# Altium project GY-G11.PRJPCB
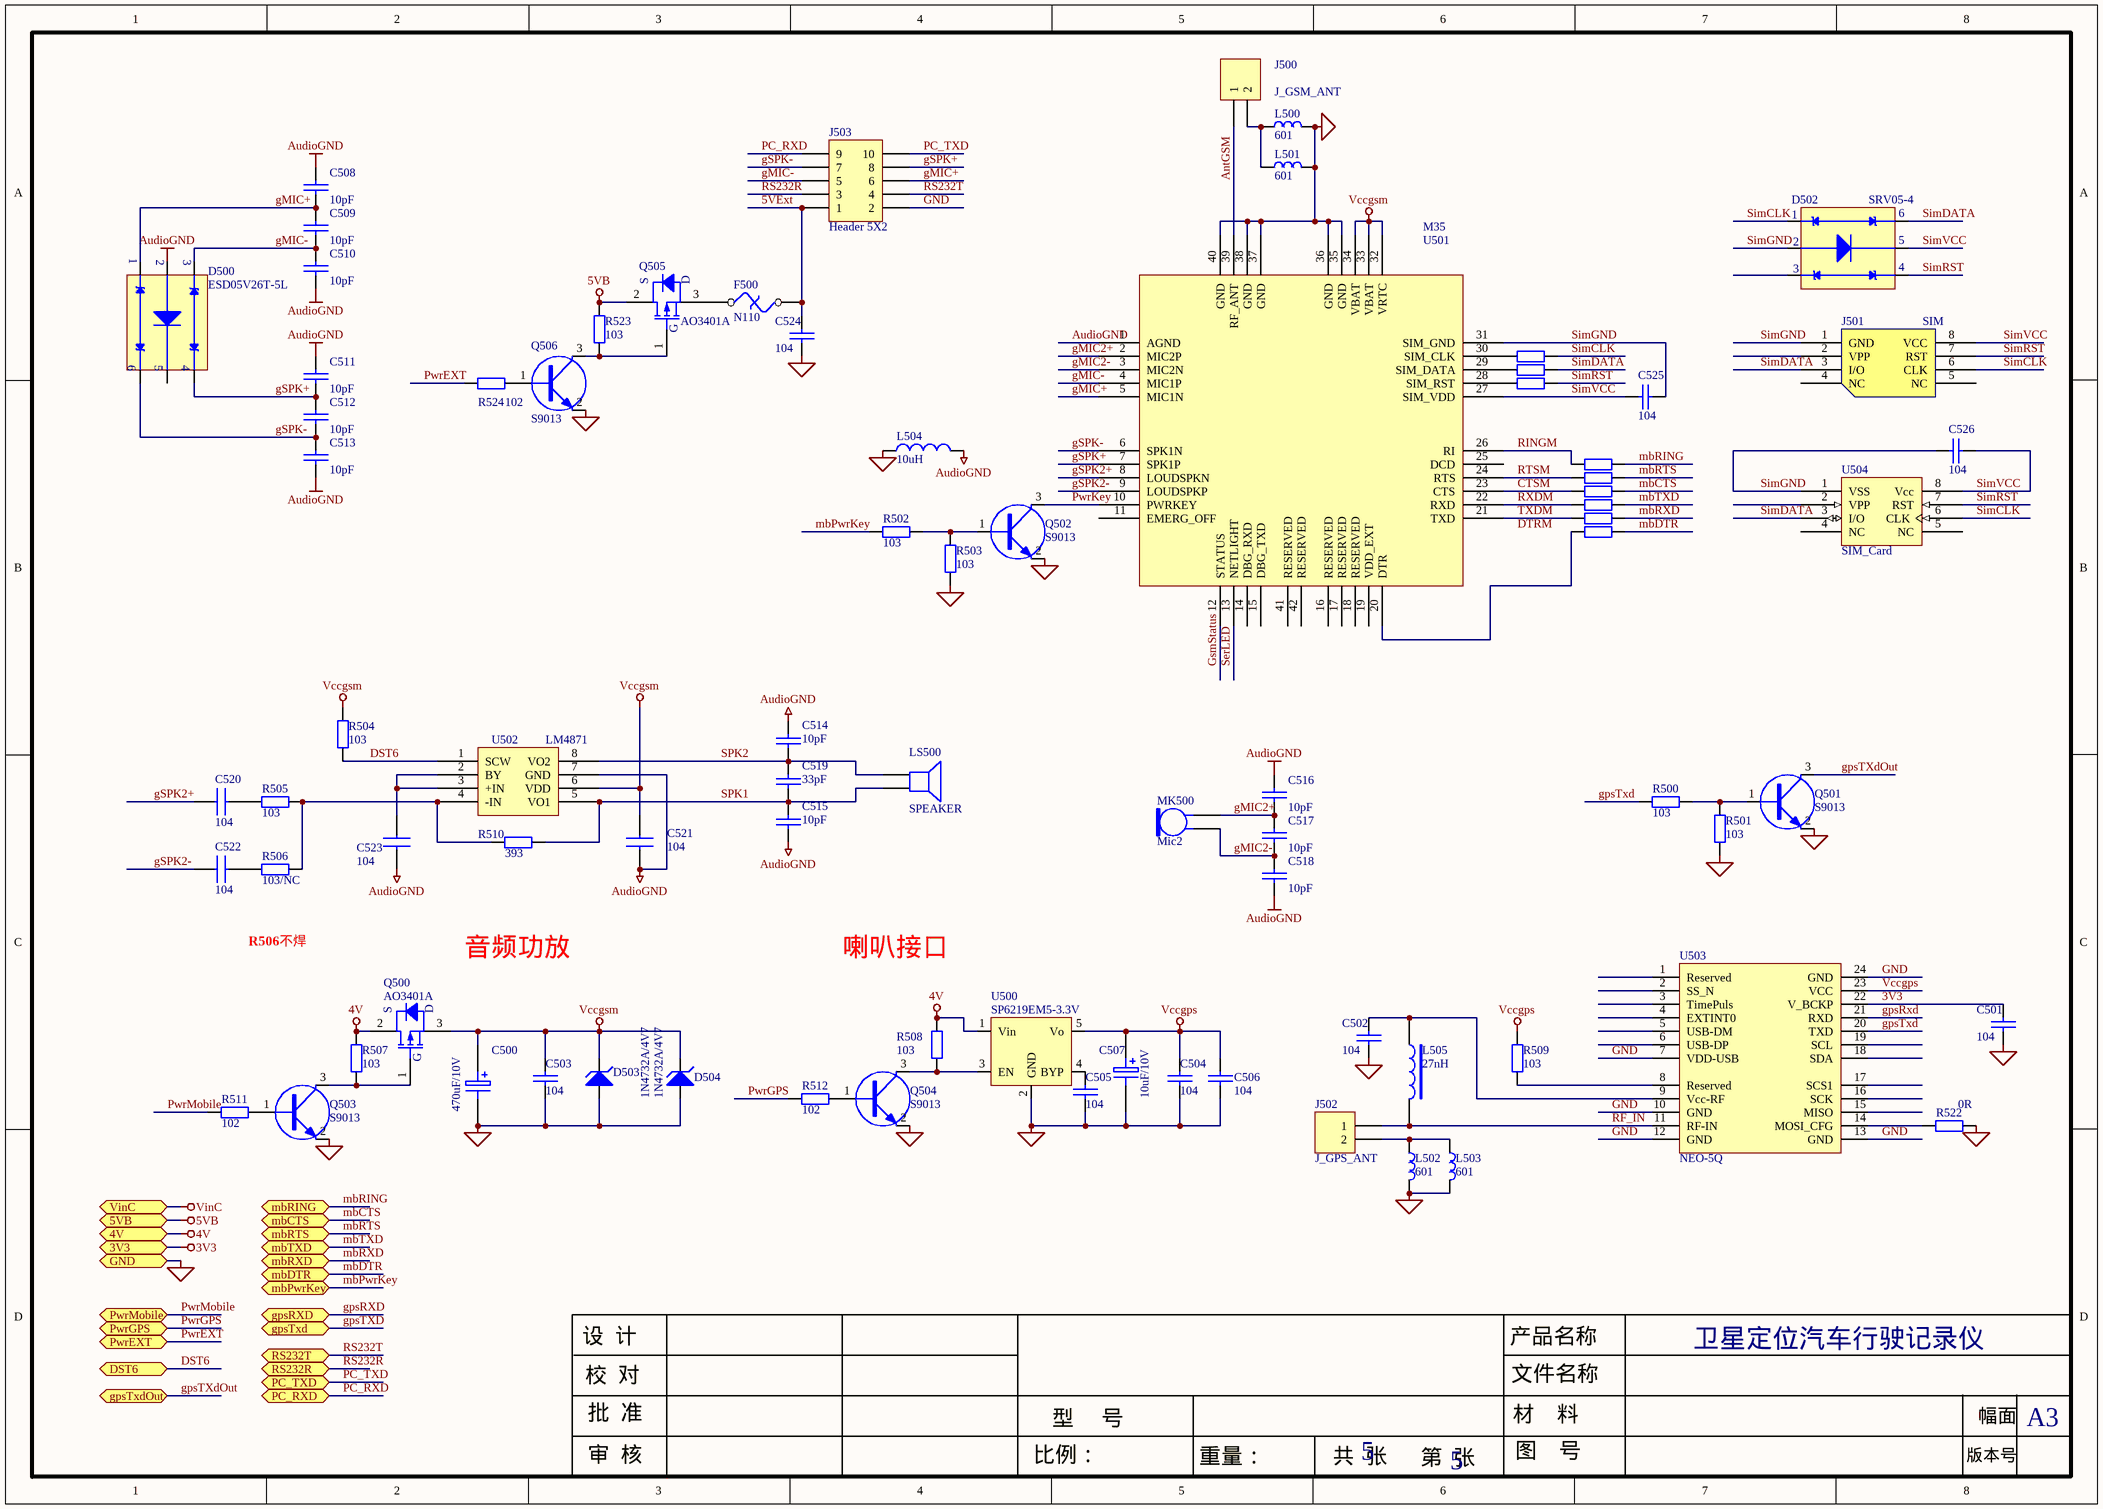
[diagram p0: G11_GPS-GSM.SCHDOC]
3 sheets, 196 parts. Net scope: flat (ports and power ports of the same name join across sheets).
Board file: GY-G11.PCBDOC
Sheets:
  G11_GPS-GSM.SCHDOC
  G11-KeyDispPrint.SCHDOC
  G11_IO_ADC.SCHDOC

## Sheet G11_GPS-GSM.SCHDOC
size A3; SheetNumber: 0; SheetTotal: 0

### Parts
C500  470uF/10V  [RB-3.5mm]
C501  104  [C0603]
C502  104  [C0603]
C503  104  [C0603]
C504  104  [C0603]
C505  104  [C0603]
C506  104  [C0603]
C507  10uF/10V  [A(3216)]
C508  10pF  [C0603]
C509  10pF  [C0603]
C510  10pF  [C0603]
C511  10pF  [C0603]
C512  10pF  [C0603]
C513  10pF  [C0603]
C514  10pF  [C0603]
C515  10pF  [C0603]
C516  10pF  [C0603]
C517  10pF  [C0603]
C518  10pF  [C0603]
C519  33pF  [C0603]
C520  104  [C0603]
C521  104  [C0603]
C522  104  [C0603]
C523  104  [C0603]
C524  104  [C0603]
C525  104  [C0603]
C526  104  [C0603]
D500  ESD05V26T-5L  [SOT-236]
D502  SRV05-4  [SOT-236]
D503  1N4732A/4V7  [D1206]
D504  1N4732A/4V7  [D1206]
F500  N110  [F0820]
J500  J_GSM_ANT  [ANT-SMA]
J501  SIM  [SIM3-8P]
J502  J_GPS_ANT  [ANT-SMA]
J503  Header 5X2  [HDR2X5-3MM]
L500  601  [0603]
L501  601  [0603]
L502  601  [0603]
L503  601  [0603]
L504  10uH  [0603]
L505  27nH  [0603]
LS500  SPEAKER  [BT-2.0]
MK500  Mic2  [BT-2.0]
Q500  AO3401A  [SOT-233PM]
Q501  S9013  [SOT-233]
Q502  S9013  [SOT-233]
Q503  S9013  [SOT-233]
Q504  S9013  [SOT-233]
Q505  AO3401A  [SOT-233PM]
Q506  S9013  [SOT-233]
R500  103  [R0603]
R501  103  [R0603]
R502  103  [R0603]
R503  103  [R0603]
R504  103  [R0603]
R505  103  [R0603]
R506  103/NC  [R0603]
R507  103  [R0603]
R508  103  [R0603]
R509  103  [R0603]
R510  393  [R0603]
R511  102  [R0603]
R512  102  [R0603]
R513  18R  [R0603]  (value not drawn)
R514  18R  [R0603]  (value not drawn)
R515  18R  [R0603]  (value not drawn)
R516  471  [R0603]  (value not drawn)
R517  471  [R0603]  (value not drawn)
R518  471  [R0603]  (value not drawn)
R519  471  [R0603]  (value not drawn)
R520  471  [R0603]  (value not drawn)
R521  471  [R0603]  (value not drawn)
R522  0R  [R0603]
R523  103  [R0603]
R524  102  [R0603]
U500  SP6219EM5-3.3V  [SOT-235]
U501  M35  [M35]
U502  LM4871  [SMD8A]
U503  NEO-5Q  [NEO-5Q]
U504  SIM_Card  [QFN5*6-8]

### Ports
3V3 (bidir), 4V (bidir), 5VB (bidir), DST6 (bidir), GND (bidir), gpsRXD (bidir), gpsTxd (bidir), gpsTxdOut (bidir), mbCTS (bidir), mbDTR (bidir), mbPwrKey (bidir), mbRING (bidir), mbRTS (bidir), mbRXD (bidir), mbTXD (bidir), PC_RXD (bidir), PC_TXD (bidir), PwrEXT (bidir), PwrGPS (bidir), PwrMobile (bidir), RS232R (bidir), RS232T (bidir), VinC (bidir)

### Nets
3V3: C501.1 U503.22(V_BCKP) ; port 3V3
4V: Q500.2(D) R507.1 R508.2 U500.1(Vin) ; port 4V
5VB: Q505.2(D) R523.1 ; port 5VB
AudioGND: C508.1 C510.2 C511.1 C513.2 C514.2 C515.1 C516.1 C518.2 C521.2 C523.2 D500.2 L504.2 U501.1(AGND) U502.7(GND)
GND: C500.2 C501.2 C502.2 C503.2 C504.2 C505.2 C506.1 C507.2 C524.2 D503.1(A) D504.1(A) J503.2 L500.2 L501.2 L502.2 L503.2 L504.1 Q501.2(E) Q502.2(E) Q503.2(E) Q504.2(E) Q506.2(E) R501.1 R503.1 R522.1 U500.2(GND) U501.35(GND) U501.36(GND) U501.37(GND) U501.38(GND) U501.40(GND) U503.7(VDD-USB) U503.10(GND) U503.12(GND) U503.13(GND) U503.24(GND) ; port GND
Vccgps: C504.1 C506.2 C507.1 R509.2 U500.5(Vo) U503.23(VCC)
Vccgsm: C500.1 C503.1 C521.1 D503.2(K) D504.2(K) Q500.3(S) R504.1 U501.32(VRTC) U501.33(VBAT) U501.34(VBAT) U502.6(VDD)
5VExt: C524.1 F500.1 J503.1
AntGSM: J500.1 U501.39(RF_ANT)
CTSM: R518.1 U501.23(CTS)
DST6: R504.2 U502.1(SCW) ; port DST6
gMIC2+: C516.2 C517.1 MK500.1 U501.2(MIC2P)
gMIC2-: C517.2 C518.1 MK500.2 U501.3(MIC2N)
gMIC+: C508.2 C509.1 D500.1 J503.6 U501.5(MIC1N)
gMIC-: C509.2 C510.1 D500.3 J503.5 U501.4(MIC1P)
gpsRxd: U503.21(RXD) ; port gpsRXD
gpsTxd: R500.2 U503.20(TXD) ; port gpsTxd
gpsTXdOut: Q501.3(C) ; port gpsTxdOut
GsmStatus: U501.12(STATUS)
gSPK2+: C520.1 U501.8(LOUDSPKN)
gSPK2-: C522.1 U501.9(LOUDSPKP)
gSPK+: C511.2 C512.1 D500.4 J503.8 U501.7(SPK1P)
gSPK-: C512.2 C513.1 D500.6 J503.7 U501.6(SPK1N)
mbCTS: R518.2 ; port mbCTS
mbDTR: R521.2 ; port mbDTR
mbPwrKey: R502.2 ; port mbPwrKey
mbRING: R516.2 ; port mbRING
mbRTS: R517.2 ; port mbRTS
mbRXD: R520.2 ; port mbRXD
mbTXD: R519.2 ; port mbTXD
PC_RXD: J503.9 ; port PC_RXD
PC_TXD: J503.10 ; port PC_TXD
PwrEXT: R524.2 ; port PwrEXT
PwrGPS: R512.2 ; port PwrGPS
PwrKey: Q502.3(C) U501.10(PWRKEY)
PwrMobile: R511.2 ; port PwrMobile
RF_IN: J502.1 L505.1 U503.11(RF-IN)
RINGM: R516.1 U501.26(RI)
RS232R: J503.3 ; port RS232R
RS232T: J503.4 ; port RS232T
RTSM: R517.1 U501.24(RTS)
RXDM: R519.1 U501.22(RXD)
SerLED: U501.13(NETLIGHT)
SimCLK: D502.1 J501.6(CLK) R513.2 U504.6(CLK)
SimDATA: D502.6 J501.3(I/O) R514.2 U504.3(I/O)
SimGND: C525.2 C526.1 D502.2 J501.1(GND) U501.31(SIM_GND) U504.1(VSS)
SimRST: D502.4 J501.7(RST) R515.2 U504.7(RST)
SimVCC: C525.1 C526.2 D502.5 J501.8(VCC) U501.27(SIM_VDD) U504.8(Vcc)
SPK1: C515.2 C519.1 LS500.2 R510.2 U502.5(VO1)
SPK2: C514.1 C519.2 LS500.1 U502.8(VO2)
TXDM: R520.1 U501.21(TXD)
NetC502_1: C502.1 L505.2 U503.9(Vcc-RF)
NetC505_1: C505.1 U500.4(BYP)
NetC520_2: C520.2 R505.1
NetC522_2: C522.2 R506.1
NetC523_1: C523.1 U502.2(BY) U502.3(+IN)
NetF500_2: F500.2 Q505.3(S)
NetJ500_2: J500.2 L500.1 L501.1
NetJ502_2: J502.2 L502.1 L503.1
NetQ500_1: Q500.1(G) Q503.3(C) R507.2
NetQ501_1: Q501.1(B) R500.1 R501.2
NetQ502_1: Q502.1(B) R502.1 R503.2
NetQ503_1: Q503.1(B) R511.1
NetQ504_1: Q504.1(B) R512.1
NetQ504_3: Q504.3(C) R508.1 U500.3(EN)
NetQ505_1: Q505.1(G) Q506.3(C) R523.2
NetQ506_1: Q506.1(B) R524.1
NetR505_2: R505.2 R506.2 R510.1 U502.4(-IN)
NetR509_1: R509.1 U503.8(Reserved)
NetR513_1: R513.1 U501.30(SIM_CLK)
NetR514_1: R514.1 U501.29(SIM_DATA)
NetR515_1: R515.1 U501.28(SIM_RST)
NetR521_1: R521.1 U501.20(DTR)
NetR522_2: R522.2 U503.14(MOSI_CFG)

Not connected (* = marked no-connect by the designer): D500 5; D502 3; J501 2(VPP) 4(NC) 5(NC); U501 11(EMERG_OFF) 14(DBG_RXD) 15(DBG_TXD) 16(RESERVED) 17(RESERVED) 18(RESERVED) 19(VDD_EXT) 25(DCD) 41(RESERVED) 42(RESERVED); U503 1(Reserved) 2(SS_N) 3(TimePuls) 4(EXTINT0) 5(USB-DM) 6(USB-DP) 15(MISO) 16(SCK) 17(SCS1) 18(SDA) 19(SCL); U504 2(VPP) 4(NC) 5(NC)

### Notes on the sheet
- R506不焊
- 音频功放
- 喇叭接口
- 设  计
- 校  对
- 产品名称
- 文件名称
- 卫星定位汽车行驶记录仪
- 审  核
- 批  准
- 比例：
- 型     号
- 5
- 材    料
- 图    号
- 版本号
- 幅面
- A3
- 重量：
- 共  张
- 第  张
- Labels drawn without touching a wire or pin: DTRM

### Library data of the parts
C500 = ELECTRO1: 直插电解
C501-C506 C508-C513 C516-C519 C524-C526 = CAP: 贴片电容
  C506: C: 贴片电容
C507 = ELECTRO1: Electrolytic Capacitor
C514 C515 = CAP: Capacitor
C520-C523 = 04-02-01
D500 D502 = ESD4: 贴片ESD管; Manufacturer: Generic Components; Class: Discrete; SubClass: Diode - Zener; Published: 08/06/2000; Publisher: Altium Hobart Technology Centre
D503 D504 = D Zener: 贴片稳压管; Manufacturer: Generic Components; Class: Discrete; SubClass: Diode - Zener; Published: 08/06/2000; Publisher: Altium Hobart Technology Centre
F500 = THERMAL FUSE: 贴片自恢复保险丝; F: F
J500 = Header 2: GSM天线接口; Revision: 17-Jul-2002: Re-released for DXP Platform.; Publisher: Altium Limited
J501 = SIM_Card_Lock: 抽屉式SIM卡座
J502 = Header 2: GPS天线接口; Revision: 17-Jul-2002: Re-released for DXP Platform.; Publisher: Altium Limited
J503 = Header 5X2: Header, 5-Pin, Dual row; Revision: 17-Jul-2002: Re-released for DXP Platform.; Publisher: Altium Limited
L500-L503 = ChiZhu: 贴片磁珠; Manufacturer: Generic Components; Class: Passive; SubClass: Inductor; Published: 08/06/2000; Publisher: Altium Hobart Technology Centre; Value: 601
L504 = Inductor: 贴片电感; Manufacturer: Generic Components; Class: Passive; Published: 08/06/2000; Publisher: Altium Hobart Technology Centre; SubClass: Inductor; Value: 10uH
L505 = INDUCTOR2: 贴片电感; L: L
MK500 = Mic2: Microphone; Published: 24-Mar-1999; Revision: July-2002: Re-released for DXP Platform.; Publisher: Altium Limited
Q500 Q505 = MOSFET-P: 贴片P沟MOS管
Q501 Q502 = 9013: 贴片三极管
Q503 Q504 Q506 = 9013
R500-R503 R507 R508 R511-R521 R523 R524 = Res2: 贴片电阻; Manufacturer: Generic Components; Class: Passive; SubClass: Resistor; Value: 15K; Published: 08/06/2000; Publisher: Altium Hobart Technology Centre
R504-R506 R510 = Res2: Resistor; Manufacturer: Generic Components; Class: Passive; Value: 15K; Published: 08/06/2000; Publisher: Altium Hobart Technology Centre; SubClass: Resistor
R509 R522 = Res2: 贴片电阻; Manufacturer: Generic Components; Class: Passive; SubClass: Resistor; Value: 1K; Published: 08/06/2000; Publisher: Altium Hobart Technology Centre
U500 = SPX5205: 贴片电源LDO
U501 = M35: 贴片GPRS通讯模块
U502 = LM4871: 音频放大器
U503 = NEO-5Q: 定位模块
U504 = SIM_Card: 贴片SIM卡; FRAM: EEPROM WatchDog(贴片)

## Sheet G11-KeyDispPrint.SCHDOC
size A3; SheetNumber: 0; SheetTotal: 0
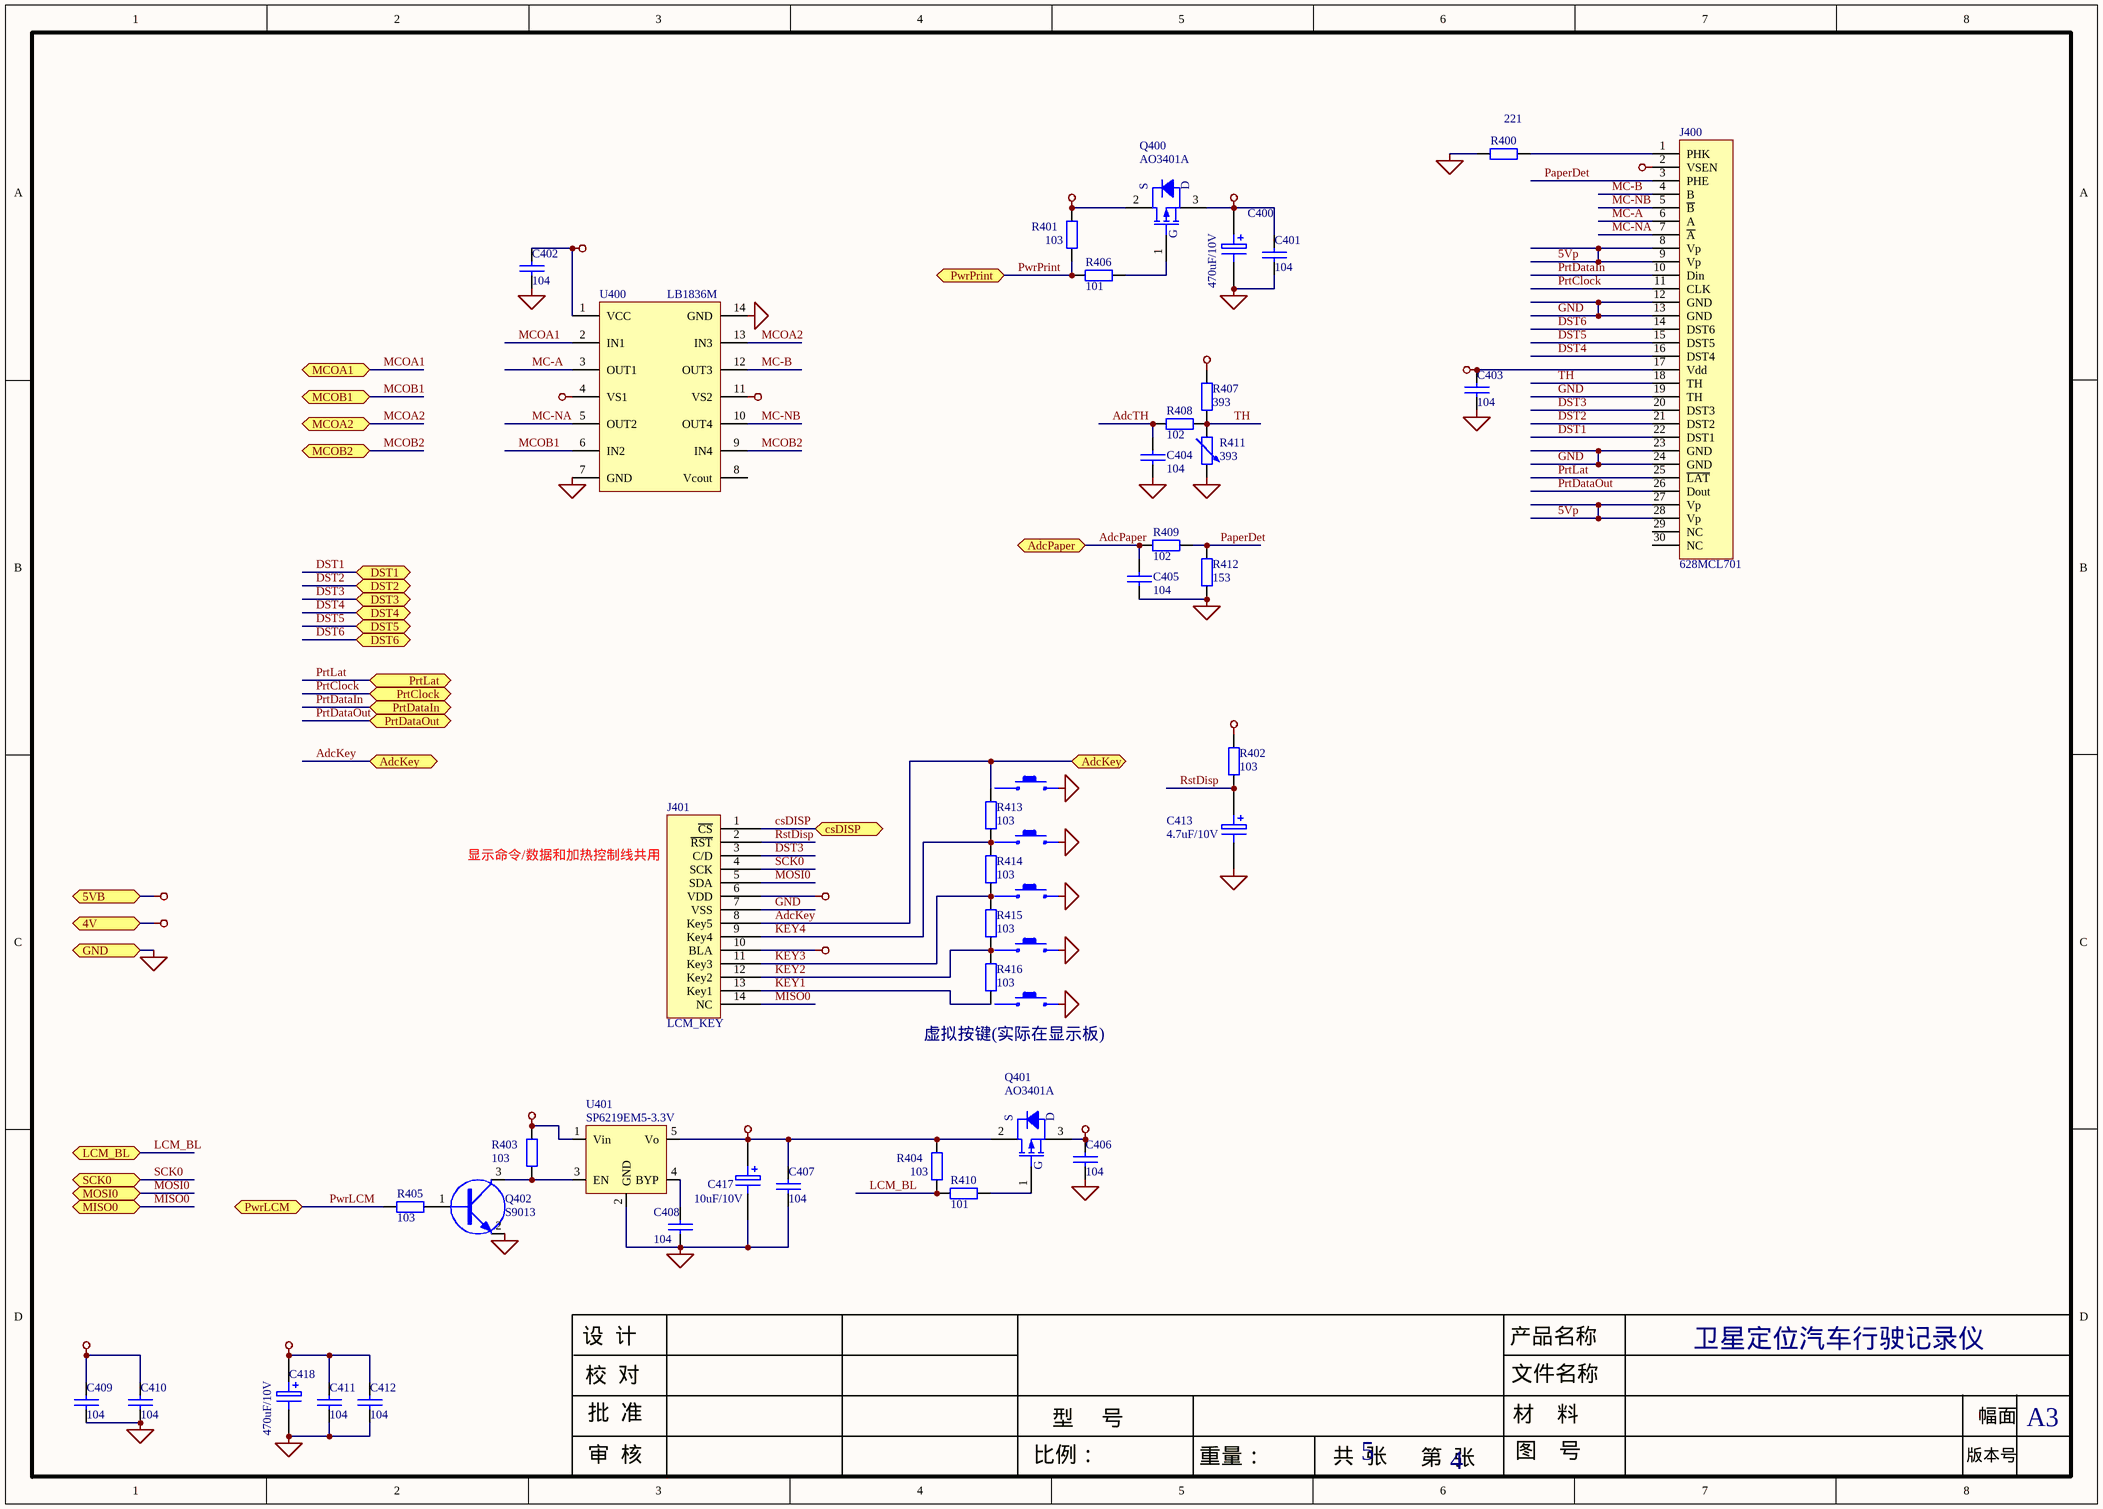
[diagram p1: G11-KeyDispPrint.SCHDOC]

### Parts
C400  470uF/10V  [RB-3.5mm]
C401  104  [C0603]
C402  104  [C0603]
C403  104  [C0603]
C404  104  [C0603]
C405  104  [C0603]
C406  104  [C0603]
C407  104  [C0603]
C408  104  [C0603]
C409  104  [C0603]
C410  104  [C0603]
C411  104  [C0603]
C412  104  [C0603]
C413  4.7uF/10V  [A(3216)]
C417  10uF/10V  [A(3216)]
C418  470uF/10V  [RB-3.5mm]
J400  628MCL701  [FPC-30H]
J401  LCM_KEY  [FPC-14-1.0]
Q400  AO3401A  [SOT-233PM]
Q401  AO3401A  [SOT-233PM]
Q402  S9013  [SOT-233]
R400  221  [R0603]
R401  103  [R0603]
R402  103  [R0603]
R403  103  [R0603]
R404  103  [R0603]
R405  103  [R0603]
R406  101  [R0603]
R407  393  [R0603]
R408  102  [R0603]
R409  102  [R0603]
R410  101  [R0603]
R411  value 393  [0603]  (hidden comment: Res Adj2)
R412  153  [R0603]
R413  103  [R0603]
R414  103  [R0603]
R415  103  [R0603]
R416  103  [R0603]
U400  LB1836M  [SO-G14-1.0mm]
U401  SP6219EM5-3.3V  [SOT-235]

### Ports
4V (bidir), 5VB (bidir), AdcKey, AdcKey (bidir), AdcPaper (bidir), csDISP (bidir), DST1 (bidir), DST2 (bidir), DST3 (bidir), DST4 (bidir), DST5 (bidir), DST6 (bidir), GND (bidir), LCM_BL (bidir), MCOA1 (bidir), MCOA2 (bidir), MCOB1 (bidir), MCOB2 (bidir), MISO0 (bidir), MOSI0 (bidir), PrtClock, PrtDataIn, PrtDataOut, PrtLat, PwrLCM (bidir), PwrPrint (bidir), SCK0 (bidir)

### Nets
3V3Lcm: C407.2 C417.1 J401.6(VDD) Q401.2(D) R402.1 R404.1 U401.5(Vo)
3V_BL: C406.2 J401.10(BLA) Q401.3(S)
4V: R403.2 U401.1(Vin) ; port 4V
5VB: C402.2 C409.2 C410.2 C411.2 C412.2 C418.1 Q400.2(D) R401.1 R407.1 U400.1(VCC) U400.4(VS1) U400.11(VS2) ; port 5VB
5Vp: C400.1 C401.2 C403.2 J400.2(VSEN) J400.8(Vp) J400.9(Vp) J400.17(Vdd) J400.27(Vp) J400.28(Vp) Q400.3(S)
GND: C400.2 C401.1 C402.1 C403.1 C404.2 C405.2 C406.1 C407.1 C408.1 C409.1 C410.1 C411.1 C412.1 C413.2 C417.2 C418.2 J400.12(GND) J400.13(GND) J400.19(TH) J400.23(GND) J400.24(GND) J401.7(VSS) Q402.2(E) R400.1 R411.2 R412.2 U400.7(GND) U400.14(GND) U401.2(GND) ; port GND
AdcKey: J401.8(Key5) R413.1 ; port AdcKey
AdcPaper: C405.1 R409.1 ; port AdcPaper
AdcTH: C404.1 R408.1
csDISP: J401.1(~{CS}) ; port csDISP
DST1: J400.22(DST1) ; port DST1
DST2: J400.21(DST2) ; port DST2
DST3: J400.20(DST3) J401.3(C/D) ; port DST3
DST4: J400.16(DST4) ; port DST4
DST5: J400.15(DST5) ; port DST5
DST6: J400.14(DST6) ; port DST6
KEY1: J401.13(Key1) R416.2
KEY2: J401.12(Key2) R415.2 R416.1
KEY3: J401.11(Key3) R414.2 R415.1
KEY4: J401.9(Key4) R413.2 R414.1
LCM_BL: R404.2 R410.2 ; port LCM_BL
MC-A: J400.6(A) U400.3(OUT1)
MC-B: J400.4(B) U400.12(OUT3)
MC-NA: J400.7(~{A}) U400.5(OUT2)
MC-NB: J400.5(~{B}) U400.10(OUT4)
MCOA1: U400.2(IN1) ; port MCOA1
MCOA2: U400.13(IN3) ; port MCOA2
MCOB1: U400.6(IN2) ; port MCOB1
MCOB2: U400.9(IN4) ; port MCOB2
MISO0: J401.14(NC) ; port MISO0
MOSI0: J401.5(SDA) ; port MOSI0
PaperDet: J400.3(PHE) R409.2 R412.1
PrtClock: J400.11(CLK) ; port PrtClock
PrtDataIn: J400.10(Din) ; port PrtDataIn
PrtDataOut: J400.26(Dout) ; port PrtDataOut
PrtLat: J400.25(~{LAT}) ; port PrtLat
PwrLCM: R405.2 ; port PwrLCM
PwrPrint: R401.2 R406.2 ; port PwrPrint
RstDisp: C413.1 J401.2(~{RST}) R402.2
SCK0: J401.4(SCK) ; port SCK0
TH: J400.18(TH) R407.2 R408.2 R411.1
NetC408_2: C408.2 U401.4(BYP)
NetJ400_1: J400.1(PHK) R400.2
NetQ400_1: Q400.1(G) R406.1
NetQ401_1: Q401.1(G) R410.1
NetQ402_1: Q402.1(B) R405.1
NetQ402_3: Q402.3(C) R403.1 U401.3(EN)

Not connected (* = marked no-connect by the designer): J400 29(NC) 30(NC); U400 8(Vcout)

### Notes on the sheet
- 显示命令/数据和加热控制线共用
- (near R416) 虚拟按键(实际在显示板)
- 设  计
- 校  对
- 产品名称
- 文件名称
- 卫星定位汽车行驶记录仪
- 审  核
- 批  准
- 比例：
- 型     号
- 5
- 材    料
- 图    号
- 版本号
- 幅面
- A3
- 重量：
- 共  张
- 第  张
- 4
- Labels drawn without touching a wire or pin: GND

### Library data of the parts
C400 C418 = ELECTRO1: 直插电解; C: Cap
C401-C403 C406-C412 = CAP: Capacitor; Cap: Cap
C404 C405 = CAP: Capacitor; Cap: 贴片电容
C413 = ELECTRO1: 贴片钽电容
C417 = ELECTRO1: 贴片钽电容; C: 电解电容
J400 = 628MCL701: 贴片竖焊打印机接口
Q400 Q401 = MOSFET-P: 贴片P沟MOS管
Q402 = 9013
R400-R410 R412-R416 = Res2: as R500 on sheet G11_GPS-GSM; Published: 08/06/2000; Publisher: Altium Hobart Technology Centre
R411 = Res Adj2: 贴片热敏电阻; Set Position: 0.5; Published: 8-Jun-2000; Revision: July-2002: Re-released for DXP Platform.; Publisher: Altium Limited
U400 = LB1836M: 贴片IC
U401 = SPX5205: 贴片电源LDO

## Sheet G11_IO_ADC.SCHDOC
size A3; SheetNumber: 0; SheetTotal: 0
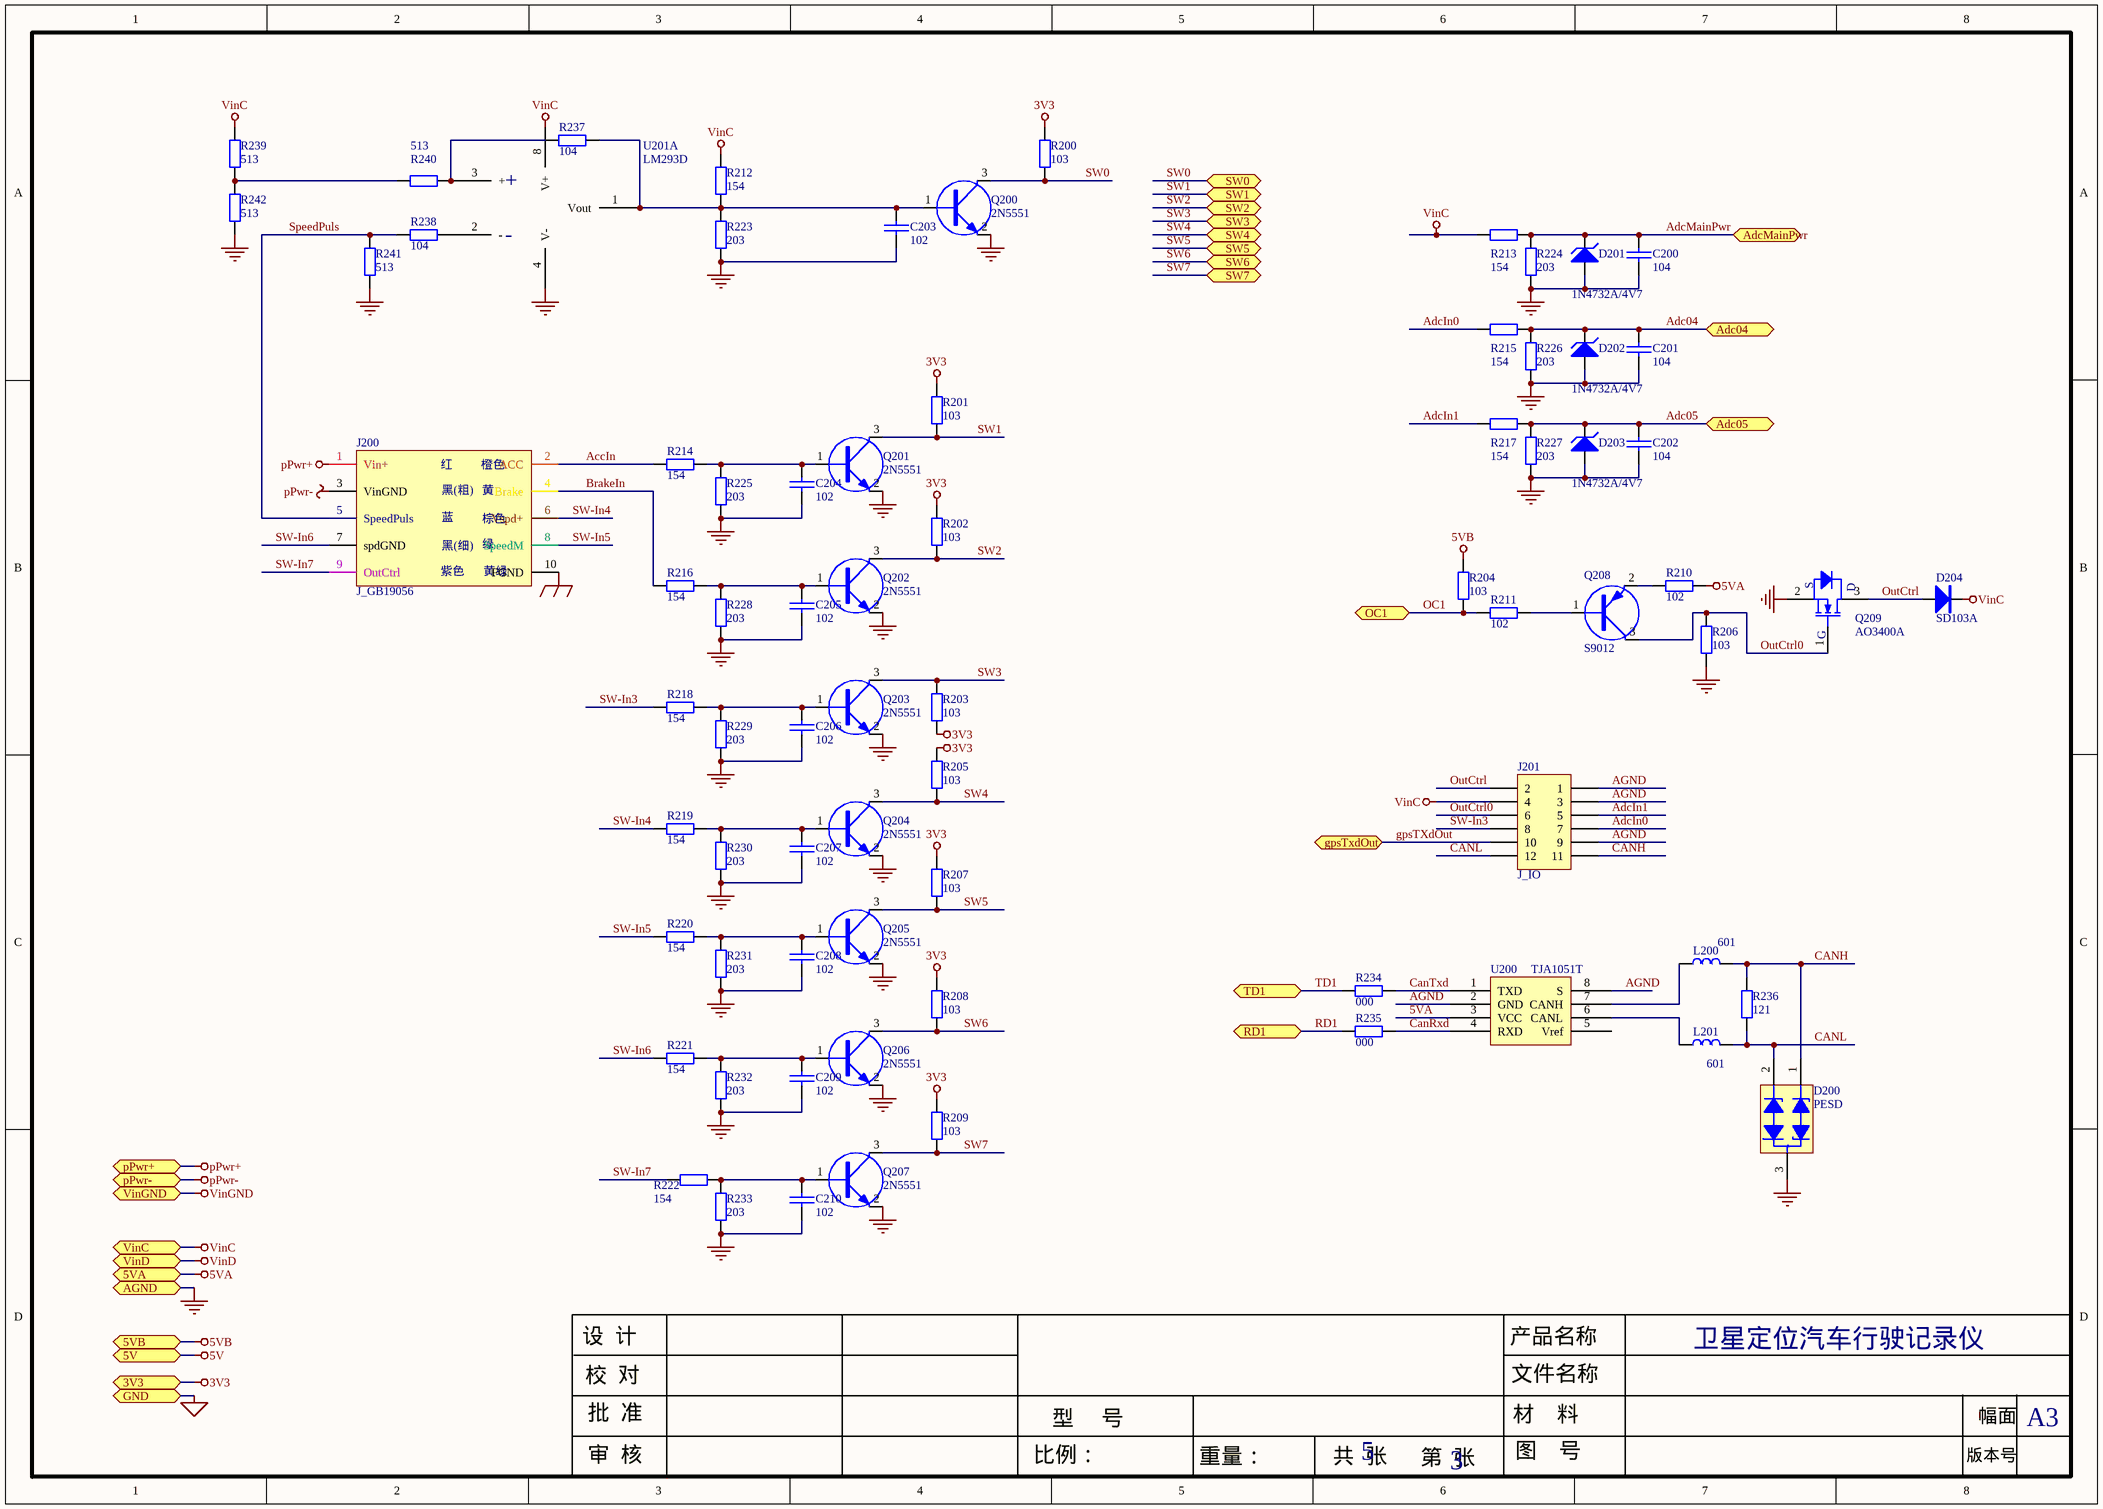
[diagram p2: G11_IO_ADC.SCHDOC]

### Parts
C200  104  [C0603]
C201  104  [C0603]
C202  104  [C0603]
C203  102  [C0603]
C204  102  [C0603]
C205  102  [C0603]
C206  102  [C0603]
C207  102  [C0603]
C208  102  [C0603]
C209  102  [C0603]
C210  102  [C0603]
D200  PESD  [SOT-233]
D201  1N4732A/4V7  [D1206]
D202  1N4732A/4V7  [D1206]
D203  1N4732A/4V7  [D1206]
D204  SD103A  [D1206]
J200  J_GB19056  [HDR5*2-4mm]
J201  J_IO  [HDR2X6-3MM]
L200  601  [0603]
L201  601  [0603]
Q200  2N5551  [SOT-233]
Q201  2N5551  [SOT-233]
Q202  2N5551  [SOT-233]
Q203  2N5551  [SOT-233]
Q204  2N5551  [SOT-233]
Q205  2N5551  [SOT-233]
Q206  2N5551  [SOT-233]
Q207  2N5551  [SOT-233]
Q208  S9012  [SOT-233]
Q209  AO3400A  [SOT-233NM]
R200  103  [R0603]
R201  103  [R0603]
R202  103  [R0603]
R203  103  [R0603]
R204  103  [R0603]
R205  103  [R0603]
R206  103  [R0603]
R207  103  [R0603]
R208  103  [R0603]
R209  103  [R0603]
R210  102  [R0603]
R211  102  [R0603]
R212  154  [R0603]
R213  154  [R0603]
R214  154  [R0603]
R215  154  [R0603]
R216  154  [R0603]
R217  154  [R0603]
R218  154  [R0603]
R219  154  [R0603]
R220  154  [R0603]
R221  154  [R0603]
R222  154  [R0603]
R223  203  [R0603]
R224  203  [R0603]
R225  203  [R0603]
R226  203  [R0603]
R227  203  [R0603]
R228  203  [R0603]
R229  203  [R0603]
R230  203  [R0603]
R231  203  [R0603]
R232  203  [R0603]
R233  203  [R0603]
R234  000  [R0603]
R235  000  [R0603]
R236  121  [R0603]
R237  104  [R0603]
R238  104  [R0603]
R239  513  [R0603]
R240  513  [R0603]
R241  513  [R0603]
R242  513  [R0603]
U200  TJA1051T  [SMD8A]
U201  LM293D  [SMD8A]  (part A of 2)

### Ports
3V3 (bidir), 5V (bidir), 5VA (bidir), 5VB (bidir), Adc04, Adc05, AdcMainPwr, AGND (bidir), GND (bidir), gpsTxdOut (bidir), OC1, pPwr+ (bidir), pPwr- (bidir), RD1, SW0 (bidir), SW1 (bidir), SW2 (bidir), SW3 (bidir), SW4 (bidir), SW5 (bidir), SW6 (bidir), SW7 (bidir), TD1, VinC (bidir), VinD (bidir), VinGND (bidir)

### Nets
3V3: R200.1 R201.1 R202.1 R203.2 R205.1 R207.1 R208.1 R209.1 ; port 3V3
5V: port 5V
5VA: R210.2 U200.3(VCC) ; port 5VA
5VB: R204.1 ; port 5VB
AGND: C200.2 C201.2 C202.2 C203.2 C204.2 C205.2 C206.2 C207.2 C208.2 C209.2 C210.2 D200.3 D201.1(A) D202.1(A) D203.1(A) J201.1 J201.3 J201.9 Q200.2(E) Q201.2(E) Q202.2(E) Q203.2(E) Q204.2(E) Q205.2(E) Q206.2(E) Q207.2(E) Q209.2(S) R206.2 R223.1 R224.1 R225.1 R226.1 R227.1 R228.1 R229.1 R230.1 R231.1 R232.1 R233.1 R241.1 R242.2 U200.2(GND) U200.8(S) U201.4(V-) ; port AGND
FGND: J200.10(FGND)
pPwr+: J200.1(Vin+) ; port pPwr+
pPwr-: J200.3(VinGND) ; port pPwr-
VinC: D204.2 J201.4 R212.2 R213.1 R239.1 U201.8(V+) ; port VinC
VinD: port VinD
VinGND: port VinGND
AccIn: J200.2(ACC) R214.1
Adc04: C201.1 D202.2(K) R215.2 R226.2 ; port Adc04
Adc05: C202.1 D203.2(K) R217.2 R227.2 ; port Adc05
AdcIn0: J201.7 R215.1
AdcIn1: J201.5 R217.1
AdcMainPwr: C200.1 D201.2(K) R213.2 R224.2 ; port AdcMainPwr
BrakeIn: J200.4(Brake) R216.1
CANH: D200.1 J201.11 L200.2 R236.1
CANL: D200.2 J201.12 L201.2 R236.2
CanRxd: R235.1 U200.4(RXD)
CanTxd: R234.1 U200.1(TXD)
gpsTXdOut: J201.10 ; port gpsTxdOut
OC1: R204.2 R211.1 ; port OC1
OutCtrl: D204.1 J201.2 Q209.3(D)
OutCtrl0: J201.6 Q208.3(E) Q209.1(G) R206.1
RD1: R235.2 ; port RD1
SpeedPuls: J200.5(SpeedPuls) R238.1 R241.2
SW0: Q200.3(C) R200.2 ; port SW0
SW1: Q201.3(C) R201.2 ; port SW1
SW2: Q202.3(C) R202.2 ; port SW2
SW3: Q203.3(C) R203.1 ; port SW3
SW4: Q204.3(C) R205.2 ; port SW4
SW5: Q205.3(C) R207.2 ; port SW5
SW6: Q206.3(C) R208.2 ; port SW6
SW7: Q207.3(C) R209.2 ; port SW7
SW-In3: J201.8 R218.1
SW-In4: J200.6(Vspd+) R219.1
SW-In5: J200.8(SpeedM) R220.1
SW-In6: J200.7(spdGND) R221.2
SW-In7: J200.9(OutCtrl) R222.1
TD1: R234.2 ; port TD1
NetC203_1: C203.1 Q200.1(B) R212.1 R223.2 R237.1 U201.1(Vout)
NetC204_1: C204.1 Q201.1(B) R214.2 R225.2
NetC205_1: C205.1 Q202.1(B) R216.2 R228.2
NetC206_1: C206.1 Q203.1(B) R218.2 R229.2
NetC207_1: C207.1 Q204.1(B) R219.2 R230.2
NetC208_1: C208.1 Q205.1(B) R220.2 R231.2
NetC209_1: C209.1 Q206.1(B) R221.1 R232.2
NetC210_1: C210.1 Q207.1(B) R222.2 R233.2
NetL200_1: L200.1 U200.7(CANH)
NetL201_1: L201.1 U200.6(CANL)
NetQ208_1: Q208.1(B) R211.2
NetQ208_2: Q208.2(C) R210.1
NetR237_2: R237.2 R240.2 U201.3(+)
NetR238_2: R238.2 U201.2(-)
NetR239_2: R239.2 R240.1 R242.1

Not connected (* = marked no-connect by the designer): U200 5(Vref)

### Notes on the sheet
- 设  计
- 校  对
- 产品名称
- 文件名称
- 卫星定位汽车行驶记录仪
- 审  核
- 批  准
- 比例：
- 型     号
- 5
- 材    料
- 图    号
- 版本号
- 幅面
- A3
- 重量：
- 共  张
- 第  张
- 3
- (in symbol J_GB19056) 红; 橙色; 黑(粗); 黄; 蓝; 棕色; 黑(细); 绿; 紫色; 黄绿

### Library data of the parts
C200-C210 = CAP: 直插安规电容; Cap: Cap
D200 = PESD1CAN: 贴片CAN总线保护器
D201-D203 = D Zener: as D503 on sheet G11_GPS-GSM; Published: 08/06/2000; Publisher: Altium Hobart Technology Centre
D204 = DIODE: 贴片二极管; D: Didoe
J200 = J_GB19056: 5.0直插弯头双排座2X5
J201 = Header 6X2: Header, 6-Pin, Dual row; Revision: 17-Jul-2002: Re-released for DXP Platform.; Publisher: Altium Limited
L200 L201 = ChiZhu: as L500 on sheet G11_GPS-GSM; Published: 08/06/2000; Publisher: Altium Hobart Technology Centre; Value: 601
Q200-Q207 = 9013: 贴片三极管
Q208 = 9012: 贴片PNP三极管
Q209 = MOSFET-N: 贴片IC,N沟MOS管
R200-R242 = Res2: as R500 on sheet G11_GPS-GSM; Published: 08/06/2000; Publisher: Altium Hobart Technology Centre
U200 = TJA1050: 贴片IC
U201 = LM358: 贴片IC

## Nets that join several sheets
3V3: G11_GPS-GSM (C501.1 U503.22), G11_IO_ADC (8 pins)
4V: G11_GPS-GSM (Q500.2 R507.1 R508.2 U500.1), G11-KeyDispPrint (R403.2 U401.1)
5VB: G11_GPS-GSM (Q505.2 R523.1), G11-KeyDispPrint (12 pins), G11_IO_ADC (R204.1)
GND: G11_GPS-GSM (36 pins), G11-KeyDispPrint (29 pins)
DST6: G11_GPS-GSM (R504.2 U502.1), G11-KeyDispPrint (J400.14)
gpsTXdOut: G11_GPS-GSM (Q501.3), G11_IO_ADC (J201.10)